# EAGLE schematic dual-motors (EAGLE 7.2.0)
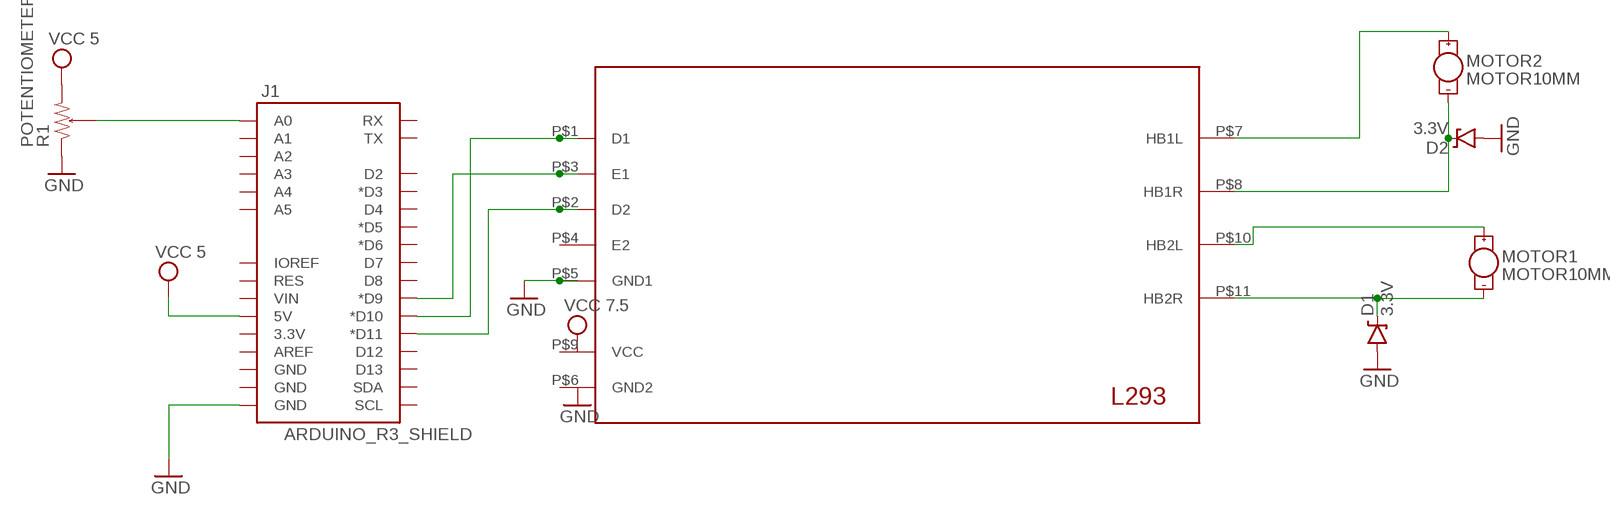
[diagram p0: schematic, sheet 1]

## Parts
D1  3.3V  DIODE-ZENER3.3V  [SOD-323]
D2  3.3V  DIODE-ZENER3.3V  [SOD-323]
J1  ARDUINO_R3_SHIELD  [UNO_R3_SHIELD]
MOTOR1  MOTOR10MM  [VIBE-MOTOR-10MM]
MOTOR2  MOTOR10MM  [VIBE-MOTOR-10MM]
R1  POTENTIOMETER  [0603-ARV]
U$2  L293  [L293]

## Nets
GND: D2.A J1.GND@0(GND) R1.1 U$2.P$5(GND1)
N$1: J1.A0 R1.3 R1.4 R1.5 R1.6 R1.7 R1.8
N$2: J1.D11(*D11) U$2.P$2(D2)
N$3: J1.D10(*D10) U$2.P$1(D1)
N$4: J1.D9(*D9) U$2.P$3(E1)
N$5: D1.C MOTOR1.- U$2.P$11(HB2R)
N$6: D1.A ; supply symbol labelled GND
N$7: MOTOR1.+ U$2.P$10(HB2L)
N$8: D2.C MOTOR2.- U$2.P$8(HB1R)
N$9: MOTOR2.+ U$2.P$7(HB1L)
VCC: J1.5V R1.2 ; supply symbol labelled VCC 5
Unconnected: J1.3.3V J1.A1 J1.A2 J1.A3 J1.A4 J1.A5 J1.AREF J1.D2 J1.D3(*D3) J1.D4 J1.D5(*D5) J1.D6(*D6) J1.D7 J1.D8 J1.D12 J1.D13 J1.GND@1(GND) J1.GND@2(GND) J1.IOREF J1.RES J1.RX J1.SCL J1.SDA J1.TX J1.VIN U$2.P$4(E2) U$2.P$6(GND2) U$2.P$9(VCC)

## Library data of the parts
D1 D2 = SparkFun-DiscreteSemi:DIODE-ZENER: Zener Diode Production Part - 8199 3.4V Zener Voltage; PROD_ID: DIO-11284
J1 = SparkFun-Boards:ARDUINO_R3_SHIELD: Shield form compatible with the Arduino Uno R3.
MOTOR1 MOTOR2 = SparkFun-Electromechanical:MOTOR: Vibration Motor- ROB-08449 Physical dimension and wire connections for this powerful vibration motor. Motor has a self adhesive backing.
R1 = SparkFun-Passives:POTENTIOMETER
U$2 = me210:L293